# EasyEDA Pro project ProPrj_MambaQuad_2026-04-23.epro, schematic Schematic3
Assembly Variant: Basic; Board Name: Board2; Create Date: 2026-01-17; Page Name: P1; Project Name: ManbaController; Schematic Name: Schematic2; Update Date: 2026-01-17; BladeWidth: 10; Company: 嘉立创EDA; Page Size: A4; RegionStart: 1; ShowBorder: 1; TitleBlock: 1; TitleBlockPosition: 3; Version: V1.0; XRegionCount: 6; YRegionCount: 4
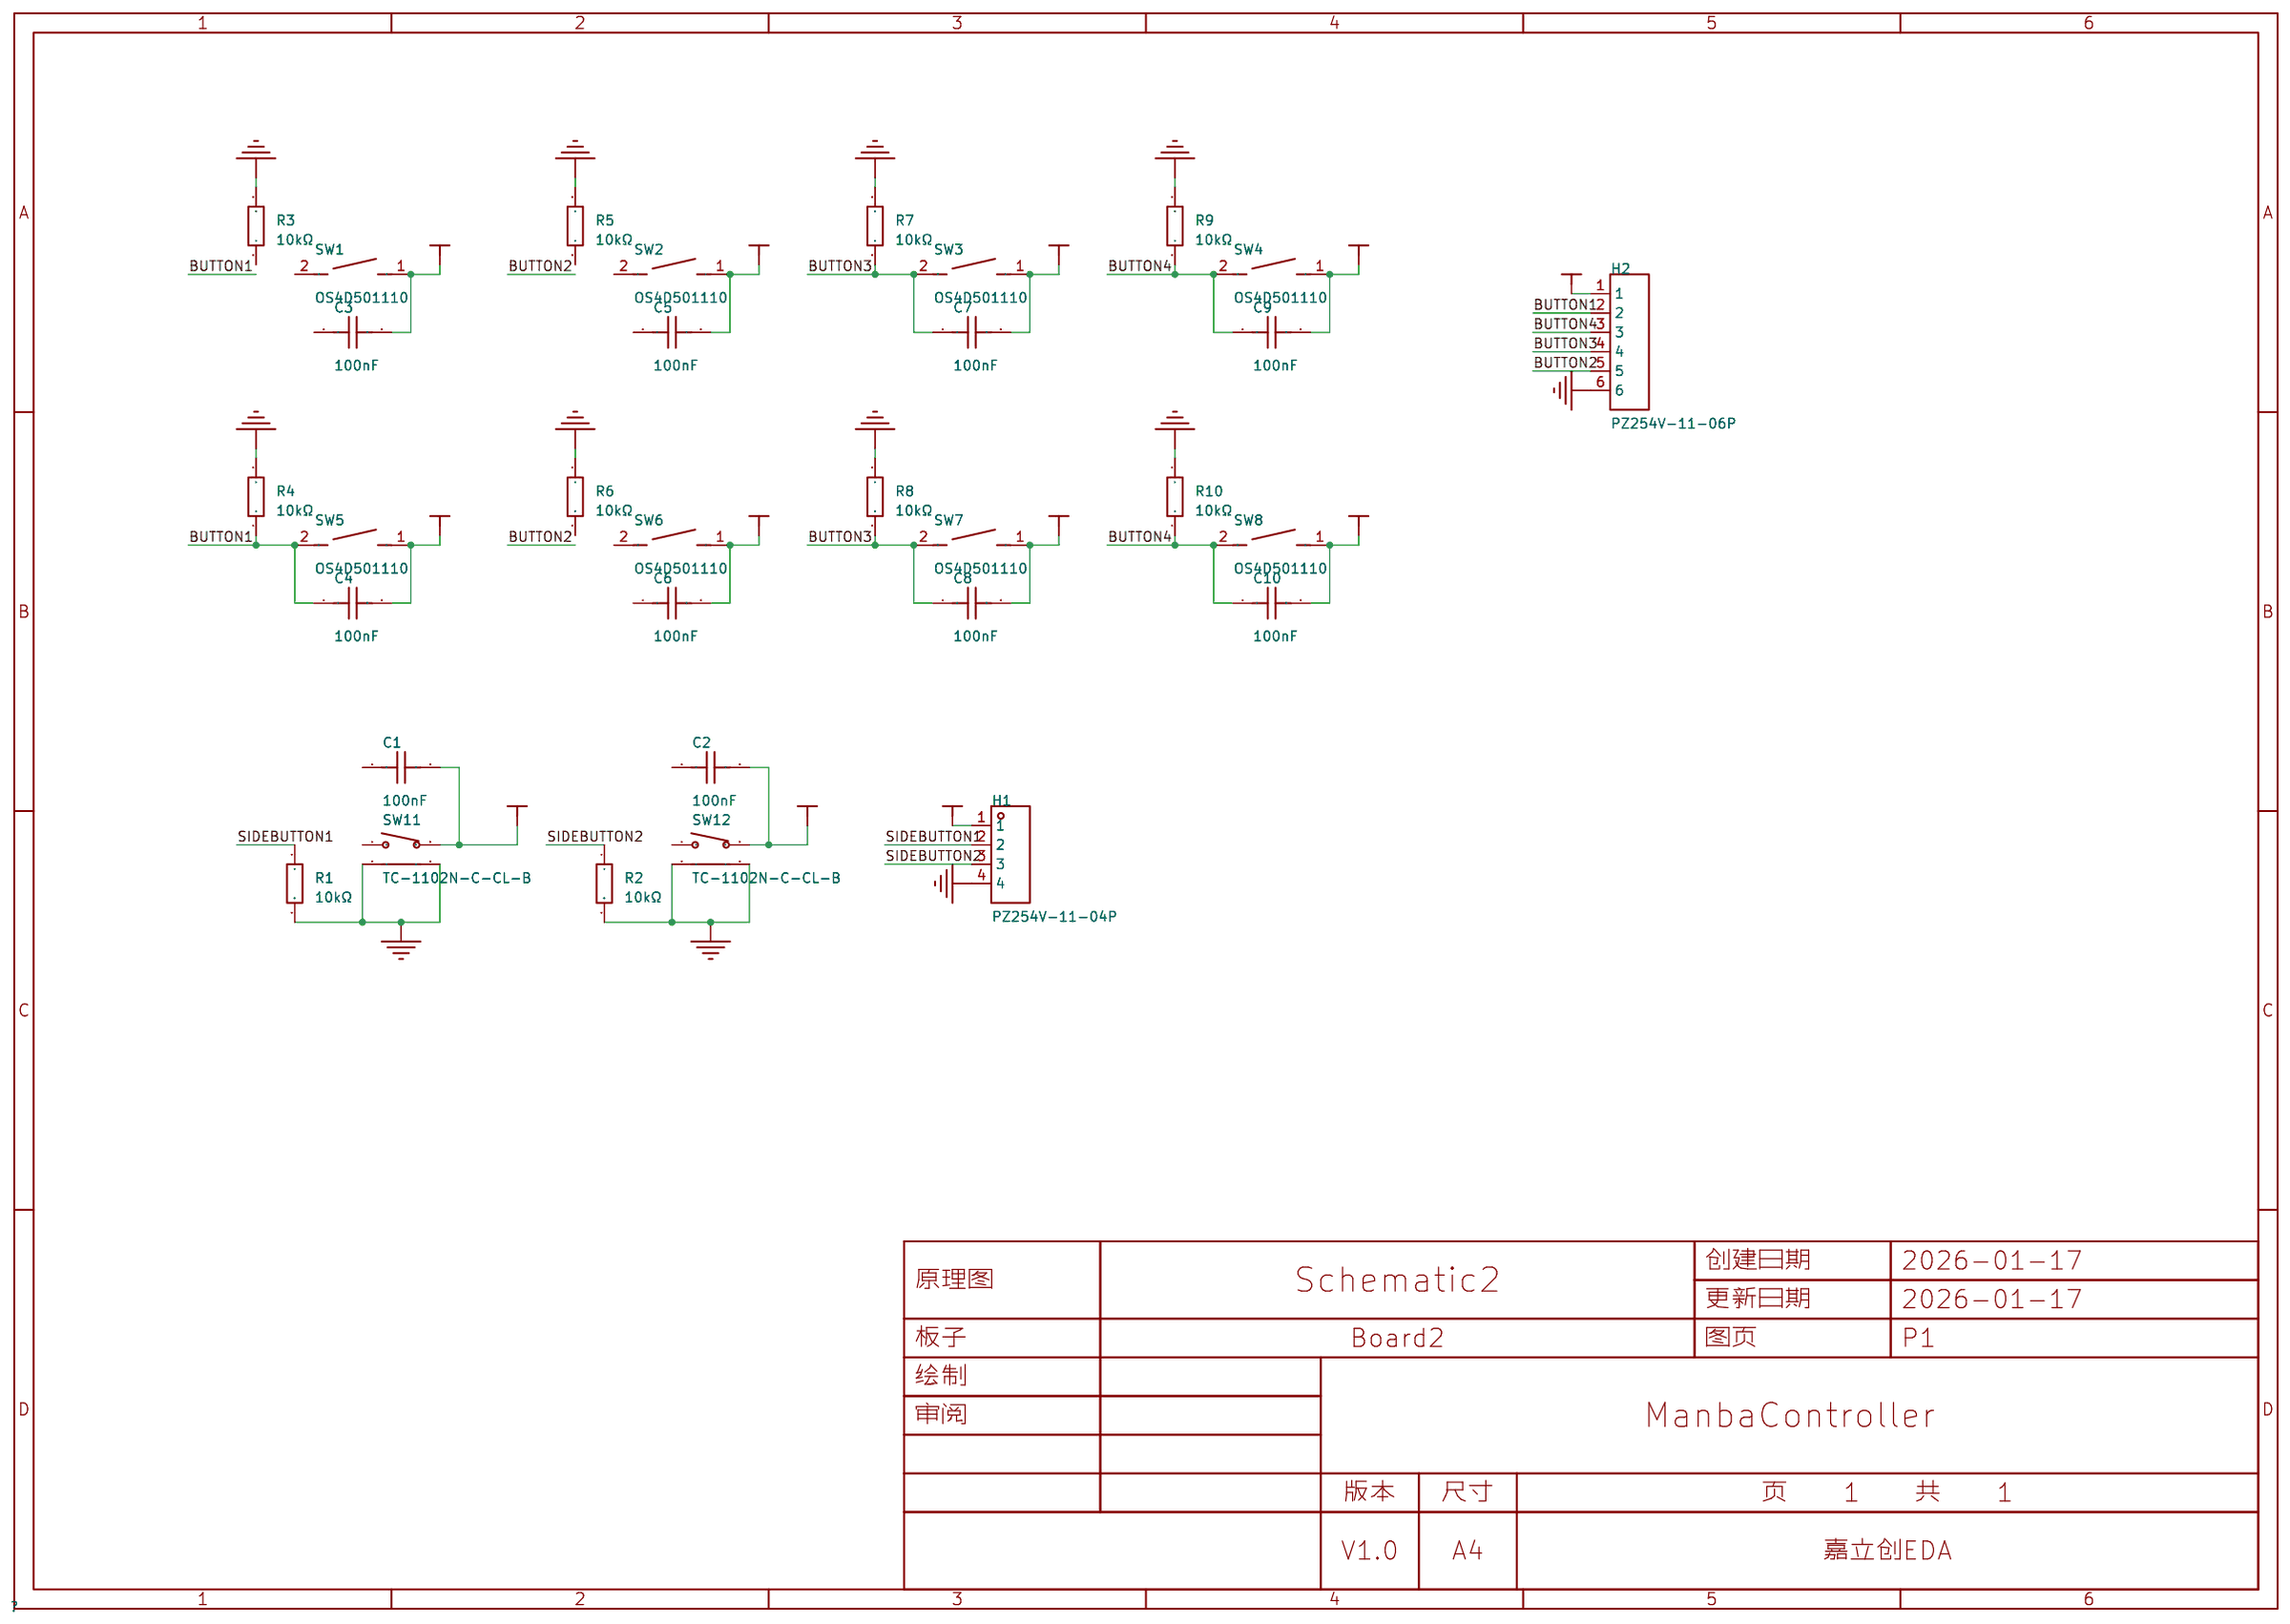
[diagram p9: schematic sheet]

## Parts
C1  100nF  [C0603_1]
C2  100nF  [C0603_1]
C3  100nF  [C0603_1]
C4  100nF  [C0603_1]
C5  100nF  [C0603_1]
C6  100nF  [C0603_1]
C7  100nF  [C0603_1]
C8  100nF  [C0603_1]
C9  100nF  [C0603_1]
C10  100nF  [C0603_1]
H1  PZ254V-11-04P  [HDR-TH_4P-P2.54-V-M]
H2  PZ254V-11-06P  [HDR-TH_6P-P2.54-V-M]
R1  10kΩ  [R0603]
R2  10kΩ  [R0603]
R3  10kΩ  [R0603]
R4  10kΩ  [R0603]
R5  10kΩ  [R0603]
R6  10kΩ  [R0603]
R7  10kΩ  [R0603]
R8  10kΩ  [R0603]
R9  10kΩ  [R0603]
R10  10kΩ  [R0603]
SW1  OS4D501110  [SW-SMD_L6.0-W6.0-P6.00-LS6.8]
SW2  OS4D501110  [SW-SMD_L6.0-W6.0-P6.00-LS6.8]
SW3  OS4D501110  [SW-SMD_L6.0-W6.0-P6.00-LS6.8]
SW4  OS4D501110  [SW-SMD_L6.0-W6.0-P6.00-LS6.8]
SW5  OS4D501110  [SW-SMD_L6.0-W6.0-P6.00-LS6.8]
SW6  OS4D501110  [SW-SMD_L6.0-W6.0-P6.00-LS6.8]
SW7  OS4D501110  [SW-SMD_L6.0-W6.0-P6.00-LS6.8]
SW8  OS4D501110  [SW-SMD_L6.0-W6.0-P6.00-LS6.8]
SW11  TC-1102N-C-CL-B  [SW-TH_TC-1102N-C-CL-B]
SW12  TC-1102N-C-CL-B  [SW-TH_TC-1102N-C-CL-B]

## Library data of the parts
C1-C10 = CGA0603X7R104K500JT: 容值:100nF;精度:±10%;额定电压:50V;温度系数:X7R;; LCSC Part Name: 100nF ±10% 50V; Supplier Part: C6119867; Manufacturer: HRE(芯声); Supplier Footprint: 0603; JLCPCB Part Class: Extended Part; Datasheet: https://item.szlcsc.com/datasheet/CGA0603X7R104K500JT/7062573.html; Supplier: LCSC; Tolerance: ±10%; Voltage Rating: 50V; Temperature Coefficient: X7R
H1 = PZ254V-11-04P: 插针结构:1x4P;间距:2.54mm;行距:-;圆针/方针:方针;安装方式:直插;排数:单排;总PIN位数:4P;额定电流:3A;额定电压:250V;配合针长度:6mm;塑高:2.5mm;端接针长度:3mm;触头材质:-;工作温度:-40℃~+105℃;颜色:黑色;; LCSC Part Name: 1x4P 间距:2.54mm 方针 直插; Supplier Part: C2691448; Manufacturer: XFCN(兴飞); Supplier Footprint: 插件,P=2.54mm; JLCPCB Part Class: Extended Part; Datasheet: https://item.szlcsc.com/datasheet/PZ254V-11-04P/2801085.html; Supplier: LCSC; Pin Structure: 1x4P; Pitch: 2.54mm; Circluar Pins/Square Pins: 方针; Mounting Type: 直插; Number of Rows: 单排; Number of Pins: 4P; Current Rating: 3A; Voltage Rating (Max): 250V; Length of Mating Pin: 6mm; Insulation Height: 2.5mm; Length of End Connection Pin: 3mm; Operating Temperature: -40℃~+105℃; Color: 黑色
H2 = PZ254V-11-06P: 插针结构:1x6P;间距:2.54mm;行距:-;圆针/方针:方针;安装方式:直插;排数:单排;总PIN位数:6P;额定电流:-;额定电压:-;配合针长度:6mm;塑高:2.5mm;端接针长度:3mm;触头材质:黄铜;触头镀层:-;工作温度:-40℃~+105℃;颜色:黑色;; LCSC Part Name: 1x6P 间距:2.54mm 方针 直插; Supplier Part: C492405; Manufacturer: XFCN(兴飞); Supplier Footprint: 插件,P=2.54mm; JLCPCB Part Class: Extended Part; Datasheet: https://item.szlcsc.com/datasheet/PZ254V-11-06P/502961.html; Supplier: LCSC; Pin Structure: 1x6P; Pitch: 2.54mm; Circluar Pins/Square Pins: 方针; Mounting Type: 直插; Number of Rows: 单排; Number of Pins: 6P; Length of Mating Pin: 6mm; Insulation Height: 2.5mm; Length of End Connection Pin: 3mm; Contact Material: 黄铜; Operating Temperature: -40℃~+105℃; Color: 黑色
R1-R10 = 0603WAF1002T5E: 电阻类型:厚膜电阻;阻值:10kΩ;精度:±1%;功率:100mW;工作电压:75V;温度系数:±100ppm/℃;; LCSC Part Name: 厚膜电阻 10kΩ ±1% 100mW; Supplier Part: C25804; Manufacturer: UNI-ROYAL(厚声); Supplier Footprint: 0603; JLCPCB Part Class: Basic Part; Datasheet: https://item.szlcsc.com/datasheet/0603WAF1002T5E/26547.html; Supplier: LCSC; Type: 厚膜电阻; Tolerance: ±1%; Power(Watts): 100mW; Voltage-Supply(Max): 75V; Temperature Coefficient: ±100ppm/℃; Operating Temperature: -55℃~+155℃
SW1-SW8 = OS4D501110: 电路结构:单刀单掷;按钮形状:圆形按钮;作用力:1.8N;安装方式:-;开关长度:6mm;开关宽度:6mm;开关高度:5mm;触点电流:50mA;额定电压:12V;带灯:无;工作寿命:10万次;; LCSC Part Name: 轻触开关6*6*5 翘两脚贴片硅胶柄无声开关 180gf; Supplier Part: C42402920; Manufacturer: SAMZO(三佐); Supplier Footprint: SMD,6x6mm; JLCPCB Part Class: Extended Part; Datasheet: https://item.szlcsc.com/datasheet/OS4D501110/44364783.html; Supplier: LCSC; Circuit: 单刀单掷; Actuator Style: 圆形按钮; Operating Force: 1.8N; Length: 6mm; Width: 6mm; Switch Height: 5mm; Contact Current: 50mA; Voltage Rating: 12V; Actuator/Cap Color: 黑色; With Lamp: 无; Life: 10万次; Operating Temperature: -25℃~+85℃
SW11 SW12 = TC-1102N-C-CL-B: 电路结构:单刀单掷;按钮形状:圆形按钮;作用力:260gf;安装方式:卧插;开关长度:6mm;开关宽度:6mm;开关高度:8.5mm;带支架:带支架;触点电流:50mA;额定电压(DC):12V;绝缘电阻:-;带灯:无;机械寿命:30万次;; LCSC Part Name: 6*6*8.5mm 卧插 轻触开关; Supplier Part: C406159; Manufacturer: XKB Connectivity(中国星坤); Supplier Footprint: 插件; JLCPCB Part Class: Extended Part; Datasheet: https://atta.szlcsc.com/upload/public/pdf/source/20211011/8943A334D21548136505FDDC6F7285B9.pdf; Supplier: LCSC; Circuit: 单刀单掷; Actuator Style: 圆形按钮; Operating Force: 260gf; Mounting Style: 卧插; Switch Length: 6mm; Switch Width: 6mm; Switch Height: 8.5mm; Strike Gundam: 带支架; Contact Current: 50mA; Voltage Rating (DC): 12V; Actuator/Cap Color: 黑色; With Lamp: 无; Pin Style: PC引脚; Mechanical Life: 30万次; Operating Temperature: -30℃~+85℃

## Nets
GND: H1.4 H2.6 R1.2 R2.2 R3.2 R4.2 R5.2 R6.2 R7.2 R8.2 R9.2 R10.2 SW11.3 SW11.4 SW12.3 SW12.4
VCC: C1.2 C2.2 C3.2 C4.2 C5.2 C6.2 C7.2 C8.2 C9.2 C10.2 H1.1 H2.1 SW1.1 SW2.1 SW3.1 SW4.1 SW5.1 SW6.1 SW7.1 SW8.1 SW11.2 SW12.2
BUTTON1: C3.1 C4.1 H2.2 R3.1 R4.1 SW1.2 SW5.2
BUTTON2: C5.1 C6.1 H2.5 R5.1 R6.1 SW2.2 SW6.2
BUTTON3: C7.1 C8.1 H2.4 R7.1 R8.1 SW3.2 SW7.2
BUTTON4: C9.1 C10.1 H2.3 R9.1 R10.1 SW4.2 SW8.2
SIDEBUTTON1: C1.1 H1.2 R1.1 SW11.1
SIDEBUTTON2: C2.1 H1.3 R2.1 SW12.1
